# Altium project TC2_Labo1_PCB.PrjPcb
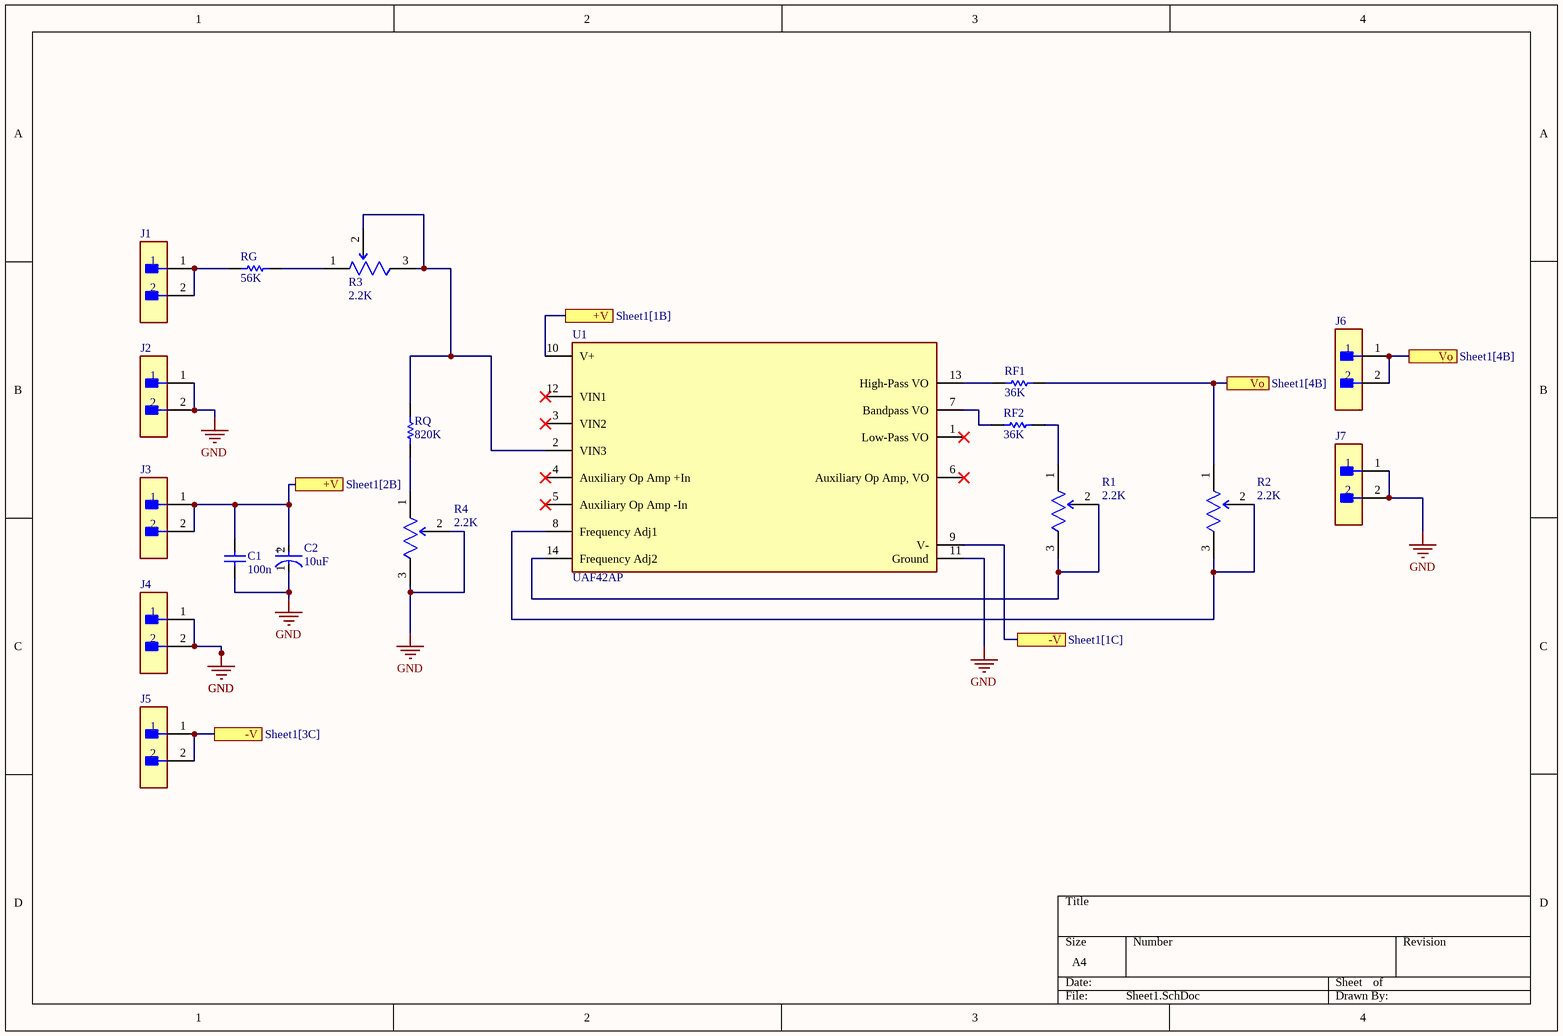
[diagram p0: Sheet1.SchDoc]
1 sheet, 18 parts. Net scope: flat (ports and power ports of the same name join across sheets).
Board file: PCB1.PcbDoc

## Sheet Sheet1.SchDoc
size A4; SheetNumber: 1; SheetTotal: 1

### Parts
C1  value 100n  (hidden comment: Capacitor)
C2  10uF  [FP-RAD-TH-D_5_0_5-L_11_1-MFG]
J1  M20-9990246  [FP-M20-9990246-MFG]  (value not drawn)
J2  M20-9990246  [FP-M20-9990246-MFG]  (value not drawn)
J3  M20-9990246  [FP-M20-9990246-MFG]  (value not drawn)
J4  M20-9990246  [FP-M20-9990246-MFG]  (value not drawn)
J5  M20-9990246  [FP-M20-9990246-MFG]  (value not drawn)
J6  M20-9990246  [FP-M20-9990246-MFG]  (value not drawn)
J7  M20-9990246  [FP-M20-9990246-MFG]  (value not drawn)
R1  2.2K  [FP-3296W-MFG]
R2  2.2K  [FP-3296W-MFG]
R3  2.2K  [FP-3296W-MFG]
R4  2.2K  [FP-3296W-MFG]
RF1  value 36K  (hidden comment: Resistor)
RF2  value 36K  (hidden comment: Resistor)
RG  value 56K  (hidden comment: Resistor)
RQ  value 820K  (hidden comment: Resistor)
U1  UAF42AP  [FP-N0014A-MFG]

### Ports
+V (see Sheet1[1B]), +V (see Sheet1[2B]), -V (see Sheet1[1C]), -V (see Sheet1[3C]), Vo (see Sheet1[4B])

### Nets
GND: C1.1 C2.1(C) J2.1 J2.2 J4.1 J4.2 J7.1 J7.2 R4.2(WIPER) R4.3(CW) U1.11(Ground)
NetC1_2: C1.2 C2.2(A) J3.1 J3.2 U1.10(V+) ; port +V
NetJ1_1: J1.1 J1.2 RG.1
NetJ5_1: J5.1 J5.2 U1.9(V-) ; port -V
NetJ6_1: J6.1 J6.2 R2.1(CCW) RF1.2 ; port Vo
NetR1_1: R1.1(CCW) RF2.2
NetR1_2: R1.2(WIPER) R1.3(CW) U1.14(Frequency_Adj2)
NetR2_2: R2.2(WIPER) R2.3(CW) U1.8(Frequency_Adj1)
NetR3_1: R3.1(CCW) RG.2
NetR3_2: R3.2(WIPER) R3.3(CW) RQ.2 U1.2(VIN3)
NetR4_1: R4.1(CCW) RQ.1
NetRF1_1: RF1.1 U1.13(High-Pass_VO)
NetRF2_1: RF2.1 U1.7(Bandpass_VO)

Not connected (* = marked no-connect by the designer): U1 1(Low-Pass_VO)* 3(VIN2)* 4(Auxiliary_Op_Amp_+In)* 5(Auxiliary_Op_Amp_-In)* 6(Auxiliary_Op_Amp,_VO)* 12(VIN1)*

### Notes on the sheet
- (in symbol CMP-05427-000260-1) +

### Library data of the parts
C1 = Capacitor: SimulationGenericComponent: True
C2 = CMP-05427-000260-1: Aluminum Electrolytic Capacitors (Radial Lead Type) AEC-Q200 Qualified 10uF ±20% 50V; Lead Diameter: 0.5mm; Polarity: Polar; Leakage Current: 3uA; Life (Hours): 1000Hour; Ripple Current: 39mA; Lead/Base Style: Straight; Max Operating Temperature: 105°C; Voltage Rating (DC): 50V; Diameter: 5mm; RoHS Compliant: Yes; Capacitance: 10uF; Packaging: Ammo Pack; Series: NHG; Construction: RADIAL; Length: 11mm; Tolerance: 20%; Height - Seated (Max): 0.472inch; Contact Plating: Tin; Height: 11mm; Min Operating Temperature: -55°C; Radiation Hardening: No; Package Quantity: 2000; Mount: Through Hole; Voltage Rating: 50V; Lead Pitch: 2.5mm; Termination: Radial; Lead Free: Lead Free; Case/Package: Radial
J1-J7 = CMP-15831-000009-1: CONN HEADER VERT 2POS 2.54MM; Manufacturer: Harwin; Conn Gender: Male; Conn Orientation: Vertical; Number Of Contacts: 2; Current Rating: 3A; ComponentLink2URL: https://cdn.harwin.com/pdfs/M20-999.pdf; ComponentLink2Description: Datasheet; Package: M20-9990246; Temperature: -40°C to +105°C; Octopart: https://octopart.com/m20-9990246-harwin-2590635; Mouser Description: 2.54mm (0.1") Pitch SIL Vertical PC Tail Pin Header, 6.1mm mating pin height, tin, 2 contacts; Temperature Range High: +105°C; Device Class L1: Connectors; RoHS: TRUE; Automotive: No; Height: 8.99mm; Number Of Rows: 1; Contact Material: Tin,Nickel; Category: Conn; Pitch: 2.54mm; Lead Free: Yes; Digikey Description: CONN HEADER VERT 2POS 2.54MM; Manufacturer Part Number: M20-9990246; Temperature Range Low: -40°C; Device Class L3: unset; Device Class L2: Headers and Wire Housings
R1-R4 = CMP-07234-000024-1: TRIMMER 10K OHM 0.5W PC PIN TOP; Resistance: 10kR; Temperature Coefficient: 100ppm/°C; Power Rating: 500mW; Tolerance: 10%; Number of Turns: 25; Width: 0.19inch; Termination: Pin; Radiation Hardening: No; Contact Plating: Tin; Composition: Cermet; Length: 9.53mm; Height: 0.395inch; Depth: 4.83mm; REACH SVHC: No SVHC; Weight: 0.03oz; Min Operating Temperature: -55°C; Military Standard: Not; Max Operating Temperature: 125°C; Packaging: Tape and Reel; Package Quantity: 1; Taper: Linear; Max Power Dissipation: 500mW; Mount: Through Hole
RF1 RF2 RG RQ = Resistor: TC1: 0; SimulationGenericComponent: True; TC2: 0
U1 = CMP-04887-000001-1: IC FILTER 100KHZ UNIV 14DIP; Dual Supply Voltage: 15V; Min Dual Supply Voltage: 6V; Supply Current: 6mA; Number of Circuits: 4; Filter Type: UNIVERSAL; Max Dual Supply Voltage: 18V; Number of Channels: 3; Radiation Hardening: No; Series: -; Packaging: Rail/Tube; Min Operating Temperature: -25°C; Lead Free: Lead Free; Length: 19.3mm; Case/Package: PDIP; Nominal Supply Current: 6mA; Weight: 0.057144oz; Package Quantity: 25; RoHS Compliant: Yes; Number of Pins: 14; REACH SVHC: No SVHC; Max Supply Voltage: 18V; Max Operating Temperature: 85°C; Width: 6.35mm; Min Supply Voltage: 6V; Type: Active; Mount: Through Hole; Height: 4.57mm